# Altium schematic sheet PCB_Sheet1.SchDoc
size A3; SheetNumber: 1; SheetTotal: 1
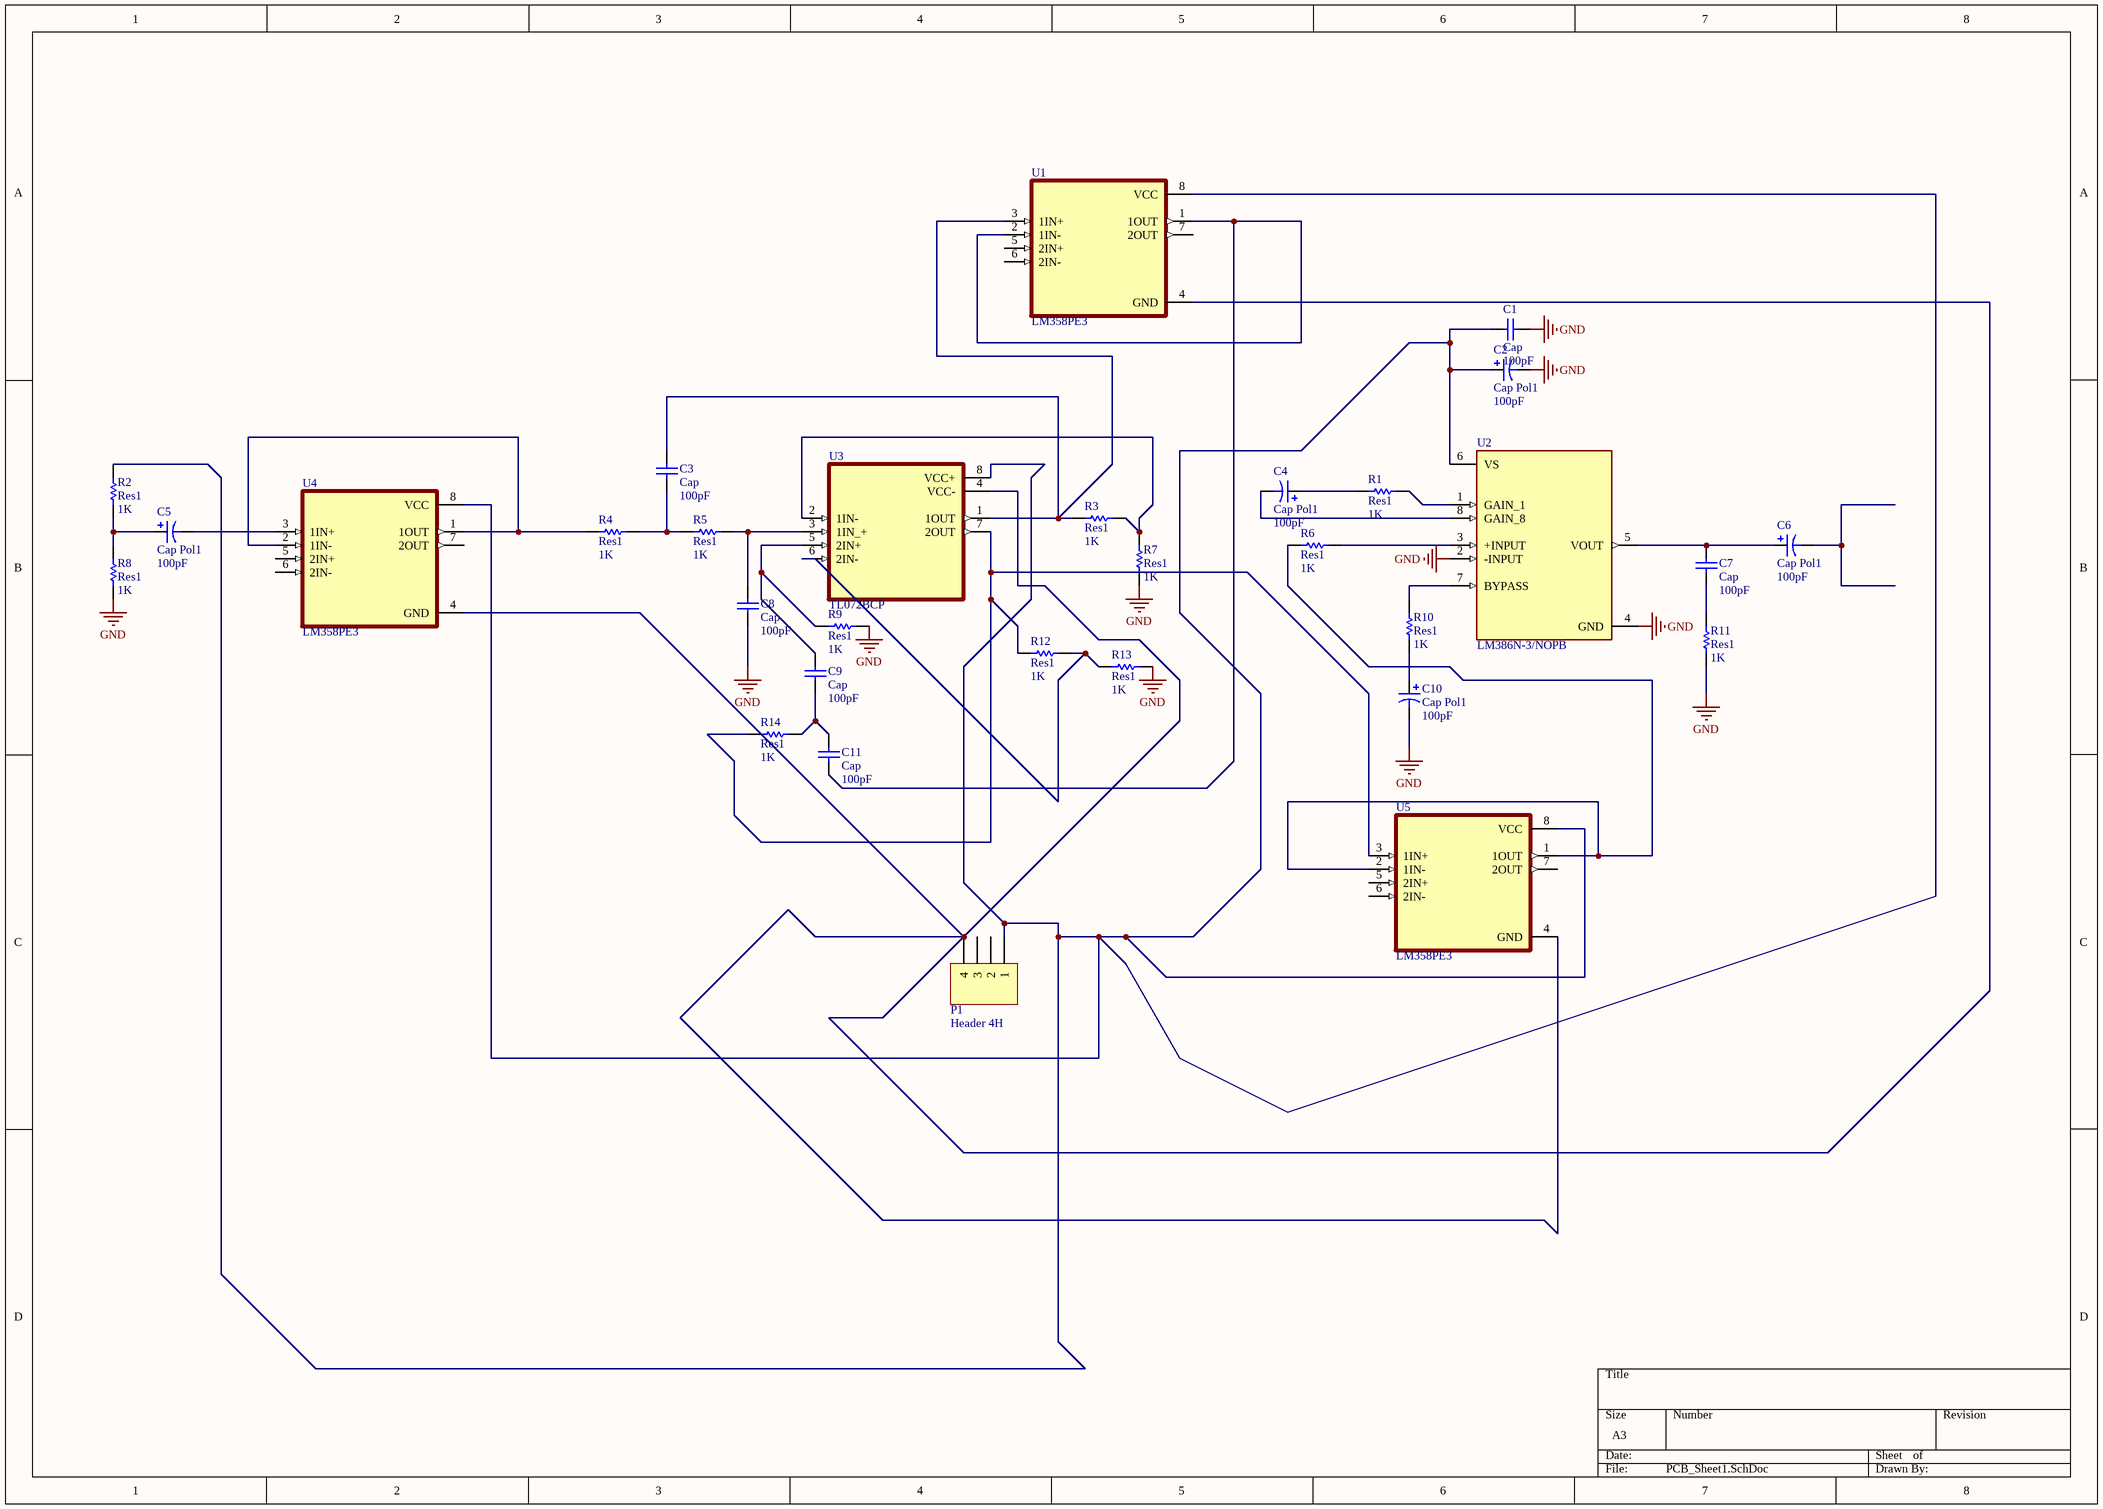
[diagram p0: PCB_Sheet1.SchDoc]

## Parts
C1  Cap  value 100pF  [RAD-0.3]
C2  Cap Pol1  value 100pF  [RB7.6-15]
C3  Cap  value 100pF  [RAD-0.3]
C4  Cap Pol1  value 100pF  [RB7.6-15]
C5  Cap Pol1  value 100pF  [RB7.6-15]
C6  Cap Pol1  value 100pF  [RB7.6-15]
C7  Cap  value 100pF  [RAD-0.3]
C8  Cap  value 100pF  [RAD-0.3]
C9  Cap  value 100pF  [RAD-0.3]
C10  Cap Pol1  value 100pF  [RB7.6-15]
C11  Cap  value 100pF  [RAD-0.3]
P1  Header 4H  [HDR1X4H]
R1  Res1  value 1K  [AXIAL-0.3]
R2  Res1  value 1K  [AXIAL-0.3]
R3  Res1  value 1K  [AXIAL-0.3]
R4  Res1  value 1K  [AXIAL-0.3]
R5  Res1  value 1K  [AXIAL-0.3]
R6  Res1  value 1K  [AXIAL-0.3]
R7  Res1  value 1K  [AXIAL-0.3]
R8  Res1  value 1K  [AXIAL-0.3]
R9  Res1  value 1K  [AXIAL-0.3]
R10  Res1  value 1K  [AXIAL-0.3]
R11  Res1  value 1K  [AXIAL-0.3]
R12  Res1  value 1K  [AXIAL-0.3]
R13  Res1  value 1K  [AXIAL-0.3]
R14  Res1  value 1K  [AXIAL-0.3]
U1  LM358PE3  [DIP794W45P254L959H508Q8]
U2  LM386N-3/NOPB  [DIP794W45P254L959H508Q8]
U3  TL072BCP  [DIP794W45P254L959H508Q8]
U4  LM358PE3  [DIP794W45P254L959H508Q8]
U5  LM358PE3  [DIP794W45P254L959H508Q8]

## Nets
GND: C1.1 C2.2 C8.1 C10.2 R7.2 R8.1 R9.1 R11.2 R13.1 U2.2(-INPUT) U2.4(GND)
NetC1_2: C1.2 C2.1 P1.1 R2.2 U1.8(VCC) U2.6(VS) U3.8(VCC+) U4.8(VCC) U5.8(VCC)
NetC3_1: C3.1 R4.1 R5.2
NetC3_2: C3.2 R3.1 U1.3(1IN+) U3.1(1OUT)
NetC4_1: C4.1 R1.2
NetC4_2: C4.2 U2.8(GAIN_8)
NetC5_1: C5.1 R2.1 R8.2
NetC5_2: C5.2 U4.3(1IN+)
NetC6_1: C6.1 C7.2 U2.5(VOUT)
NetC7_1: C7.1 R11.1
NetC8_2: C8.2 R5.1 U3.3(1IN_+)
NetC9_1: C9.1 C11.2 R14.1
NetC9_2: C9.2 R9.2 U3.5(2IN+)
NetC10_1: C10.1 R10.2
NetC11_1: C11.1 U1.1(1OUT) U1.2(1IN-)
NetP1_4: P1.4 U1.4(GND) U3.4(VCC-) U4.4(GND) U5.4(GND)
NetR1_1: R1.1 U2.1(GAIN_1)
NetR3_2: R3.2 R7.1 U3.2(1IN-)
NetR4_2: R4.2 U4.1(1OUT) U4.2(1IN-)
NetR6_1: R6.1 U2.3(+INPUT)
NetR6_2: R6.2 U5.1(1OUT) U5.2(1IN-)
NetR10_1: R10.1 U2.7(BYPASS)
NetR12_1: R12.1 R13.2 U3.6(2IN-)
NetR12_2: R12.2 R14.2 U3.7(2OUT) U5.3(1IN+)

Not connected (* = marked no-connect by the designer): C6 2; P1 2 3; U1 5(2IN+) 6(2IN-) 7(2OUT); U4 5(2IN+) 6(2IN-) 7(2OUT); U5 5(2IN+) 6(2IN-) 7(2OUT)

## Library data of the parts
C1 C3 C7-C9 C11 = Cap: Capacitor; Published: 8-Jun-2000; LatestRevisionDate: 17-Jul-2002; LatestRevisionNote: Re-released for DXP Platform.; PackageReference: RAD-0.3; Publisher: Altium Limited; PackageDescription: Radial Cap, Thru-Hole; 2 Leads; 0.3 in Pin Spacing
C2 C4-C6 C10 = Cap Pol1: Polarized Capacitor (Radial); Published: 8-Jun-2000; LatestRevisionDate: 17-Jul-2002; LatestRevisionNote: Re-released for DXP Platform.; PackageReference: RB7.6-15; Publisher: Altium Limited; PackageDescription: Polarized Capacitor (Radial); 2 Leads
P1 = Header 4H: Header, 4-Pin, Right Angle; LatestRevisionDate: 17-Jul-2002; LatestRevisionNote: Re-released for DXP Platform.; Publisher: Altium Limited
R1-R14 = Res1: Resistor; Published: 8-Jun-2000; LatestRevisionDate: 17-Jul-2002; LatestRevisionNote: Re-released for DXP Platform.; PackageReference: AXIAL-0.3; Publisher: Altium Limited; PackageDescription: Axial Device, Thru-Hole; 2 Leads; 0.3 in Pin Spacing
U3 = TL072BCP: Dual low-noise JFET-input low offset operational amplifier 8-PDIP 0 to 70; MF: Texas Instruments; Price: None; Purchase-URL: https://pricing.snapeda.com/search/part/TL072BCP/?ref=eda; Value: *; Check_prices: https://www.snapeda.com/parts/TL072BCP/Texas%20Instruments/view-part/511536/?ref=eda; Package: PDIP-8 Texas; SnapEDA_Link: https://www.snapeda.com/parts/TL072BCP/Texas%20Instruments/view-part/511536/?ref=snap; Availability: Warning; MP: TL072BCP
U1 U4 U5 = LM358PE3: Value: *; MP: LM358PE3; Package: None; Availability: Unavailable; Price: None
U2 = LM386N-3/NOPB: Price: None; Package: None; Availability: Unavailable; MP: LM386N-3/NOPB; Value: *